# Altium schematic sheet 充放电模块V2.SchDoc
size A3
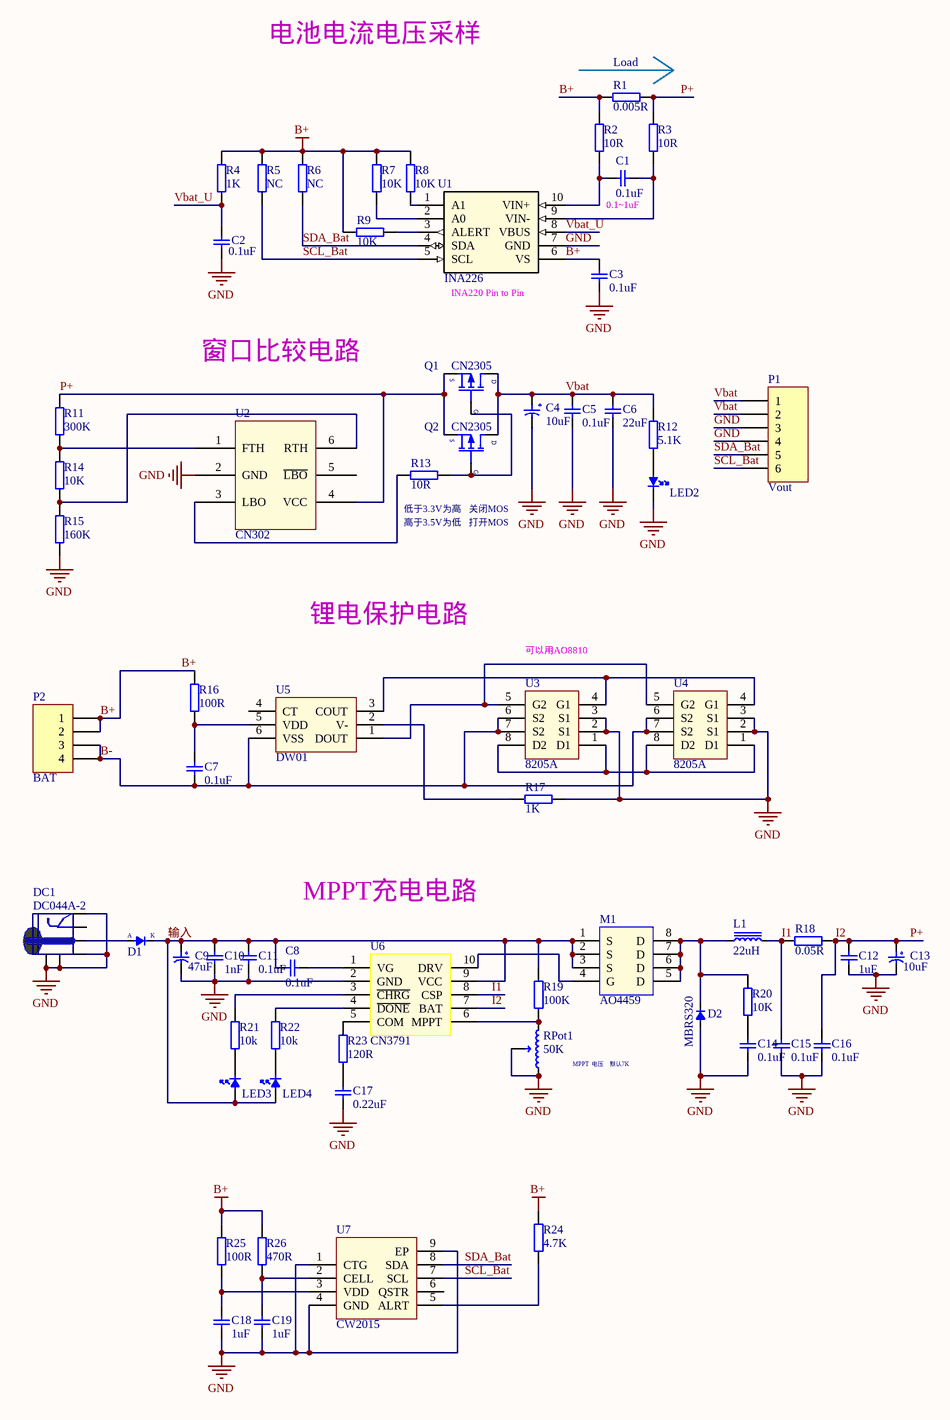
[diagram p0: 充放电模块V2.SchDoc]

## Parts
C1  0.1uF  [0603-C]
C2  0.1uF  [0603-C]
C3  0.1uF  [0603-C]
C4  10uF  [C6.3X6.3]
C5  0.1uF  [0603-C]
C6  22uF  [1206 C]
C7  0.1uF  [0603-C]
C8  0.1uF  [0603-C]
C9  47uF  [C8X8]
C10  1nF  [0603-C]
C11  0.1uF  [0603-C]
C12  1uF  [0603-C]
C13  10uF  [C6.3X6.3]
C14  0.1uF  [0603-C]
C15  0.1uF  [0603-C]
C16  0.1uF  [0603-C]
C17  0.22uF  [0603-C]
C18  1uF  [0603-C]
C19  1uF  [0603-C]
D1  二极管  [DO-214]  (value not drawn)
D2  MBRS320  [DO-214AB]
DC1  DC044A-2  [DC044A 6PIN]
L1  22uH  [L7X7]
LED2  LED  [LED0805G]  (value not drawn)
LED3  LED  [LED0805R]  (value not drawn)
LED4  LED  [LED0805G]  (value not drawn)
M1  AO4459  [SOP8]
P1  Vout  [XHS2.5-6P]
P2  BAT  [XH 2.5 AW 4PIN]
Q1  CN2305  [SOT23]
Q2  CN2305  [SOT23]
R1  0.005R  [1210R]
R2  10R  [0603-r]
R3  10R  [0603-r]
R4  1K  [0603-r]
R5  NC  [0603-r]
R6  NC  [0603-r]
R7  10K  [0603-r]
R8  10K  [0603-r]
R9  10K  [0603-r]
R11  300K  [0603-r]
R12  5.1K  [0603-r]
R13  10R  [0603-r]
R14  10K  [0603-r]
R15  160K  [0603-r]
R16  100R  [0603-r]
R17  1K  [0603-r]
R18  0.05R  [1210R]
R19  100K  [0603-r]
R20  10K  [0603-r]
R21  10k  [0603-r]
R22  10k  [0603-r]
R23  120R  [0603-r]
R24  4.7K  [0603-r]
R25  100R  [0603-r]
R26  470R  [0603-r]
RPot1  50K  [VR5 - W]
U1  INA226  [DGS10]
U2  CN302  [SOT23-6]
U3  8205A  [TSSOP8-MCP730P]
U4  8205A  [TSSOP8-MCP730P]
U5  DW01  [SOT23-6]
U6  CN3791  [SSOP10]
U7  CW2015  [QFN-8]

## Nets
B+: C3.1 P2.1 P2.2 R1.2 R2.2 R4.1 R5.2 R6.2 R7.2 R8.2 R9.2 R16.1 R24.2 R25.2 R26.2 U1.6(VS)
GND: C2.1 C3.2 C4.2 C5.2 C6.2 C9.2 C10.2 C11.2 C12.2 C13.2 C14.2 C15.2 C16.2 C17.2 C18.1 C19.1 D2.1 DC1.1 DC1.2 DC1.4 DC1.5 LED2.2 P1.3 P1.4 R15.2 R17.1 RPot1.1 RPot1.2 U1.7(GND) U2.2(GND) U3.2(S1) U3.3(S1) U4.2(S1) U4.3(S1) U6.2(GND) U7.1(CTG) U7.4(GND) U7.9(EP)
B-: C7.2 P2.3 P2.4 U3.6(S2) U3.7(S2) U4.6(S2) U4.7(S2) U5.6(VSS)
I1: C15.1 L1.2 R18.2 U6.8(CSP)
I2: C12.1 C13.1 C16.1 Q1.3(S) Q2.3(S) R1.1 R3.2 R11.1 R18.1 U2.4(VCC) U6.7(BAT)  [also labelled P+]
SCL_Bat: P1.6 R5.1 U1.5(SCL) U7.7(SCL)
SDA_Bat: P1.5 R6.1 U1.4(SDA) U7.8(SDA)
Vbat: C4.1 C5.1 C6.1 P1.1 P1.2 Q1.2(D) Q2.2(D) R12.2
Vbat_U: C2.2 R4.2 U1.8(VBUS)
输入: C8.2 C9.1 C10.1 C11.1 D1.2(K) LED3.1 LED4.1 M1.1(S) M1.2(S) M1.3(S) R19.2 U6.9(VCC)
NetC1_1: C1.1 R3.1 U1.9(VIN-)
NetC1_2: C1.2 R2.1 U1.10(VIN+)
NetC7_1: C7.1 R16.2 U5.5(VDD)
NetC8_1: C8.1 U6.1(VG)
NetC14_1: C14.1 R20.1
NetC17_1: C17.1 R23.1
NetC18_2: C18.2 R25.1 U7.3(VDD)
NetC19_2: C19.2 R26.1 U7.2(CELL)
NetD1_1: D1.1(A) DC1.3
NetD2_2: D2.2 L1.1 M1.5(D) M1.6(D) M1.7(D) M1.8(D) R20.2
NetLED2_1: LED2.1 R12.1
NetLED3_2: LED3.2 R21.1
NetLED4_2: LED4.2 R22.1
NetM1_4: M1.4(G) U6.10(DRV)
NetQ1_1: Q1.1(G) Q2.1(G) R13.2
NetR7_1: R7.1 U1.2(A0)
NetR8_1: R8.1 U1.1(A1)
NetR9_1: R9.1 U1.3(ALERT)
NetR11_2: R11.2 R14.1 U2.1(FTH)
NetR13_1: R13.1 U2.3(LBO)
NetR14_2: R14.2 R15.1 U2.6(RTH)
NetR17_2: R17.2 U5.2(V-)
NetR19_1: R19.1 RPot1.3 U6.6(MPPT)
NetR21_2: R21.2 U6.3(~{CHRG})
NetR22_2: R22.2 U6.4(~{DONE})
NetR23_2: R23.2 U6.5(COM)
NetR24_1: R24.1 U7.5(ALRT)
NetU3_1: U3.1(D1) U3.8(D2) U4.1(D1) U4.8(D2)
NetU3_4: U3.4(G1) U4.4(G1) U5.3(COUT)
NetU3_5: U3.5(G2) U4.5(G2) U5.1(DOUT)

Not connected (* = marked no-connect by the designer): DC1 6; U2 5(~{LBO}); U5 4(CT); U7 6(QSTR)

## Notes on the sheet
- 电池电流电压采样
- (near R1) Load
- (near C1) 0.1~1uF
- (near U1) INA220 Pin to Pin
- 窗口比较电路
- 低于3.3V为高   关闭MOS
- 高于3.5V为低   打开MOS
- 锂电保护电路
- (near U3) 可以用AO8810
- MPPT充电电路
- (near RPot1) MPPT  电压    默认7K

## Library data of the parts
C1-C3 C5-C8 C10-C12 C14-C19 = Cap: Capacitor; Value: 15P; Published: 8-Jun-2000; LatestRevisionDate: 17-Jul-2002; LatestRevisionNote: Re-released for DXP Platform.; Publisher: Altium Limited
C4 C9 C13 = Cap 有极性
D1 = D
D2 = 1N4148
DC1 = DC044A-2: 6PIN
L1 = Inductor: Code_IEC: 1005; Value: 3.3nH; Published: 8-Jun-2000; LatestRevisionDate: 17-Jul-2002; LatestRevisionNote: Re-released for DXP Platform.; PackageReference: 0402-A; Publisher: Altium Limited; Code_JEITA: 0402
P1 = Header 6: Header, 6-Pin; LatestRevisionDate: 17-Jul-2002; LatestRevisionNote: Re-released for DXP Platform.; Publisher: Altium Limited
P2 = Header 4: Header, 4-Pin; LatestRevisionDate: 17-Jul-2002; LatestRevisionNote: Re-released for DXP Platform.; Publisher: Altium Limited
R1-R9 R11-R26 = Res2: Resistor
RPot1 = 可调电阻
U1 = INA226_DGS_10: Imported; Manufacturer: Texas Instruments; INDUSTRY_STD_PKG_TYPE: MSOP; FAMILY_NAME: CURRENT SHUNT MONITOR; PIN_COUNT: 10; PACKAGE_DESIGNATOR: DGS; Datasheet_URL: http://www.ti.com/lit/gpn/INA226; GENERIC_PART_NUMBER: INA226; Vendor: Texas Instruments; Manufacturer_Part_Number: ina226_dgs_10; Value: Value; Type: Type; RefDes: RefDes
U2 = CN302: 如韵电池检测